# Altium schematic sheet 3d_dsn_approx.SchDoc
size A1; SheetNumber: 1; SheetTotal: 13
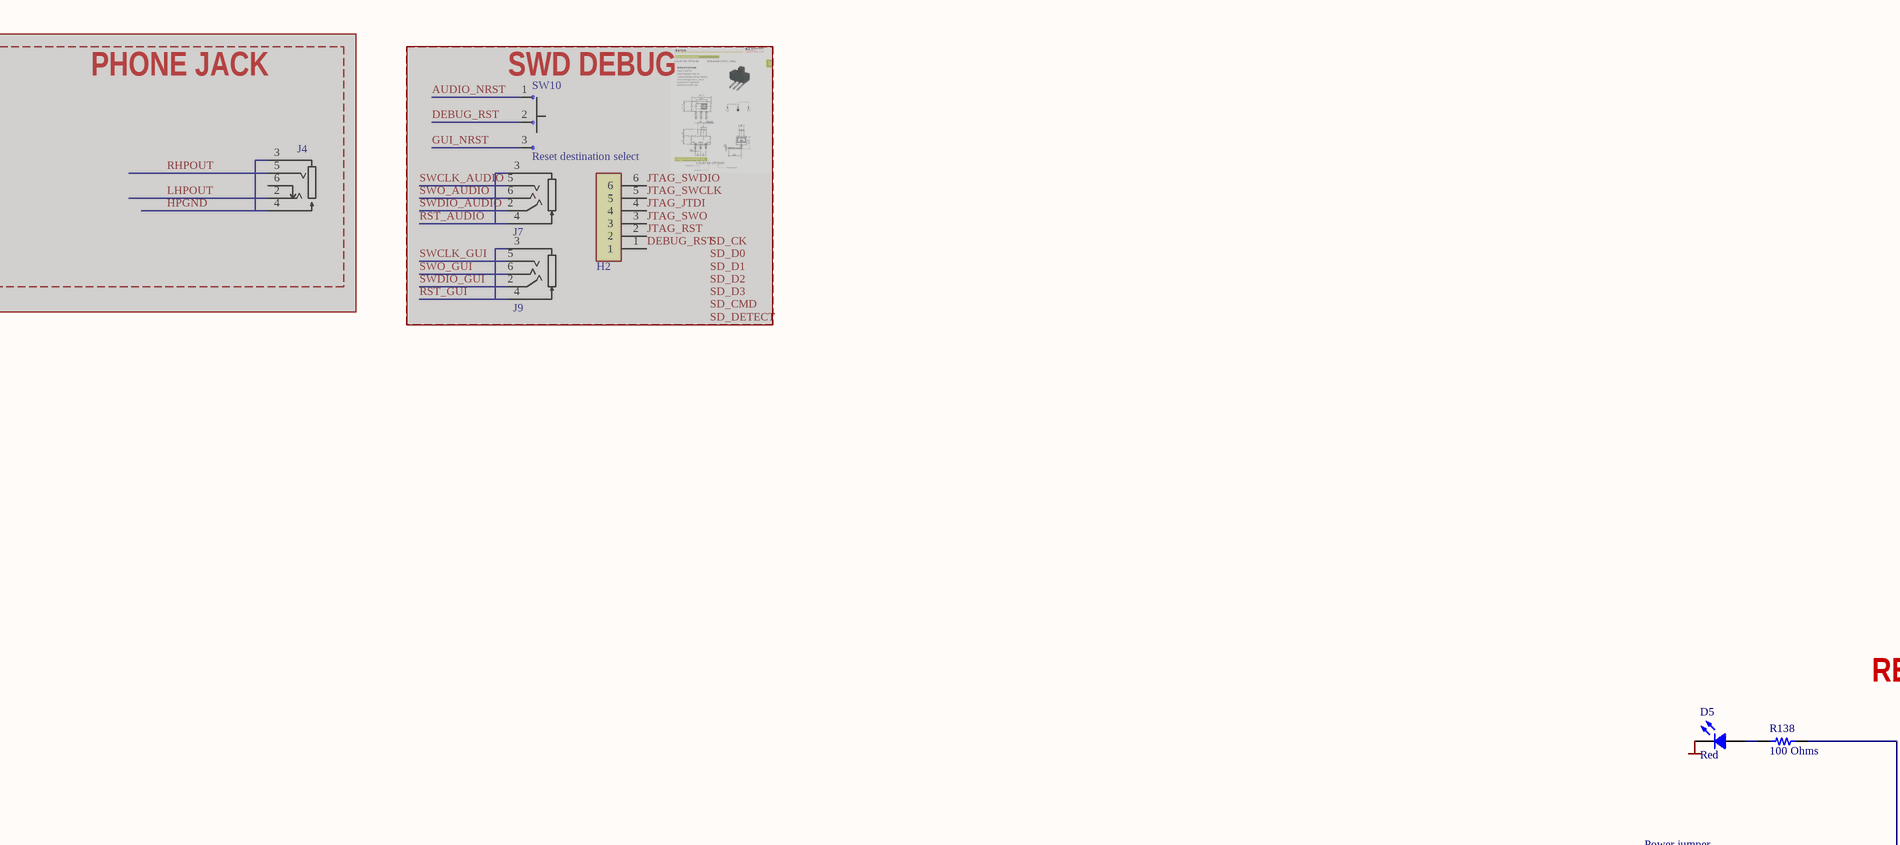
[diagram p0: 3d_dsn_approx.SchDoc, top left]
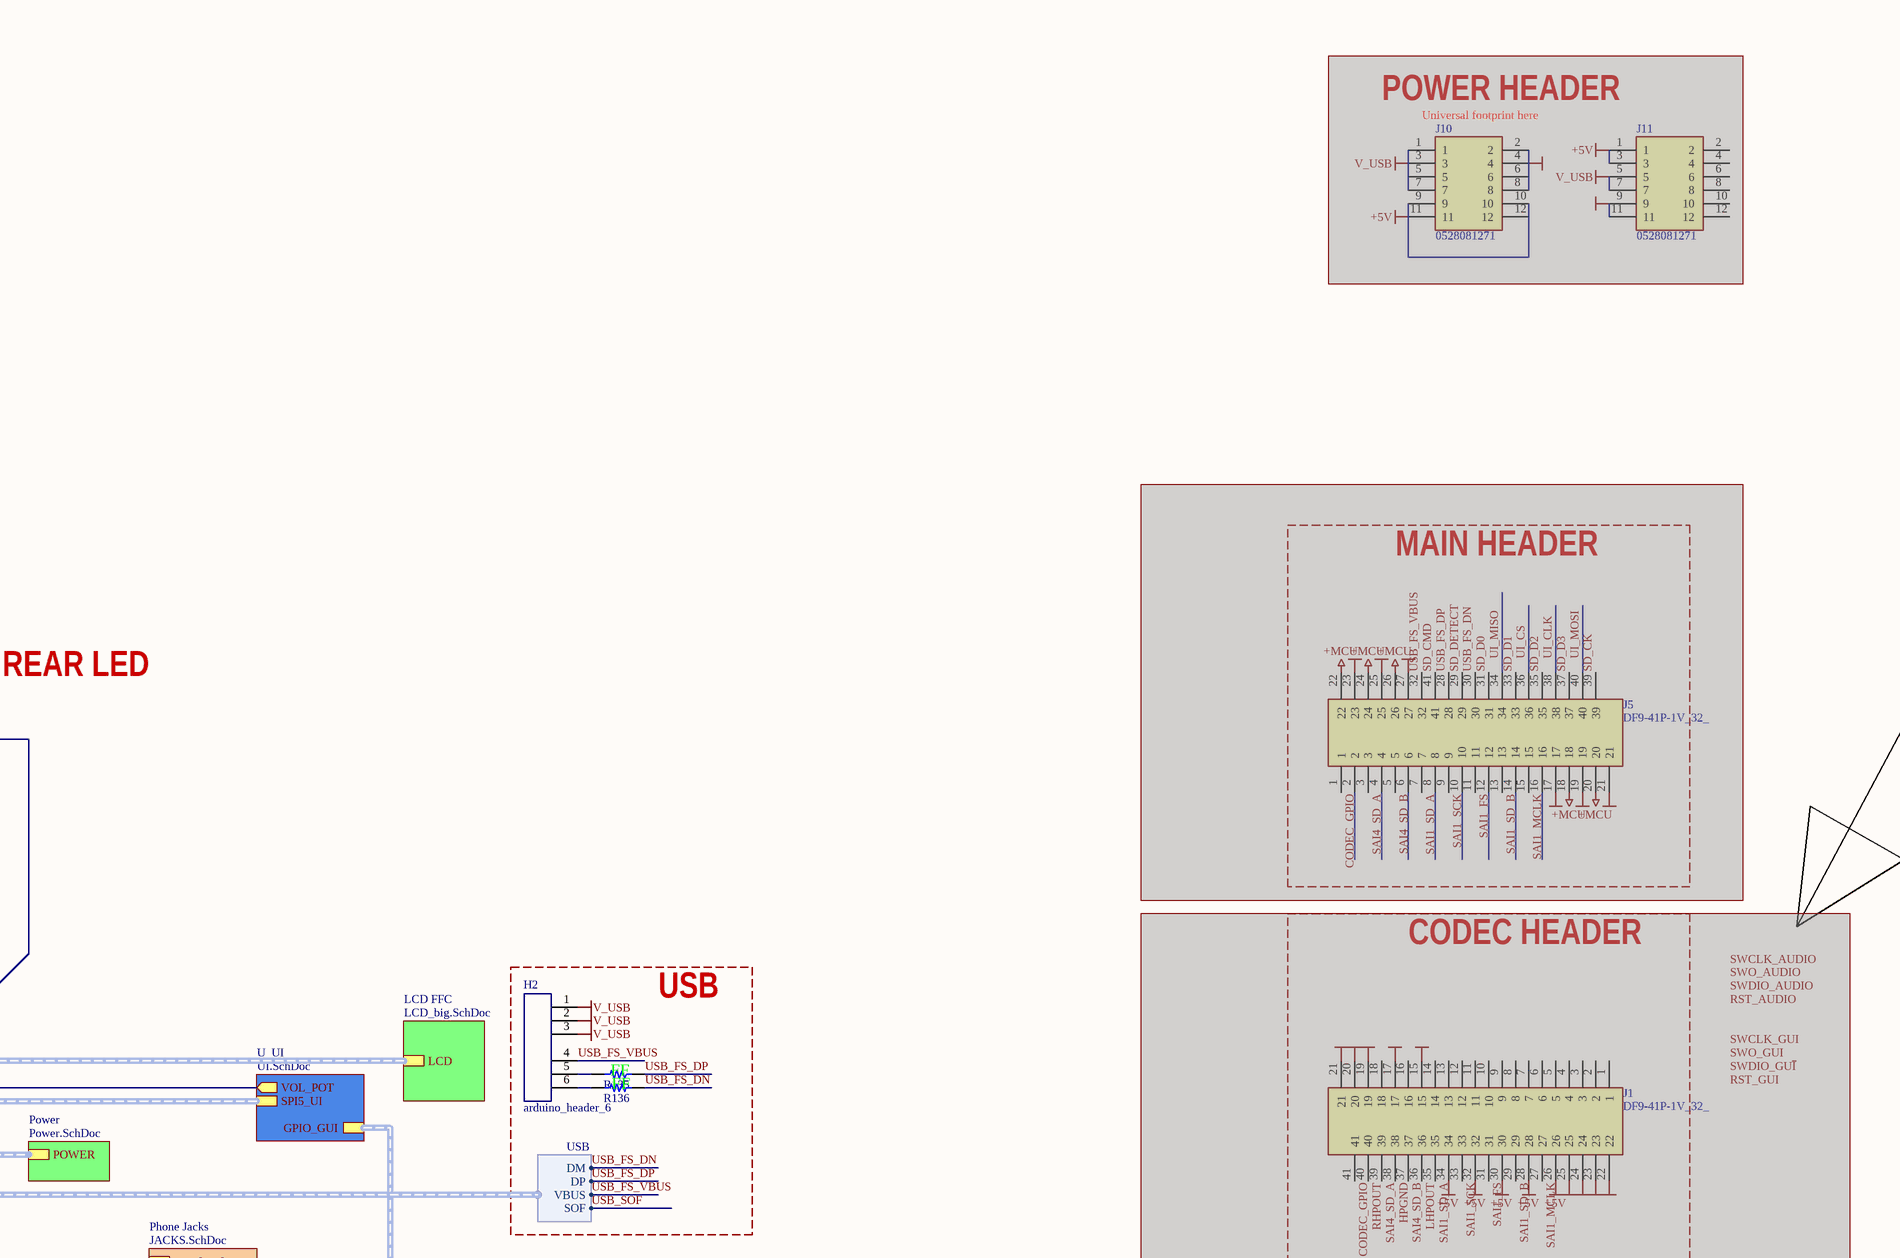
[diagram p1: 3d_dsn_approx.SchDoc, top right]
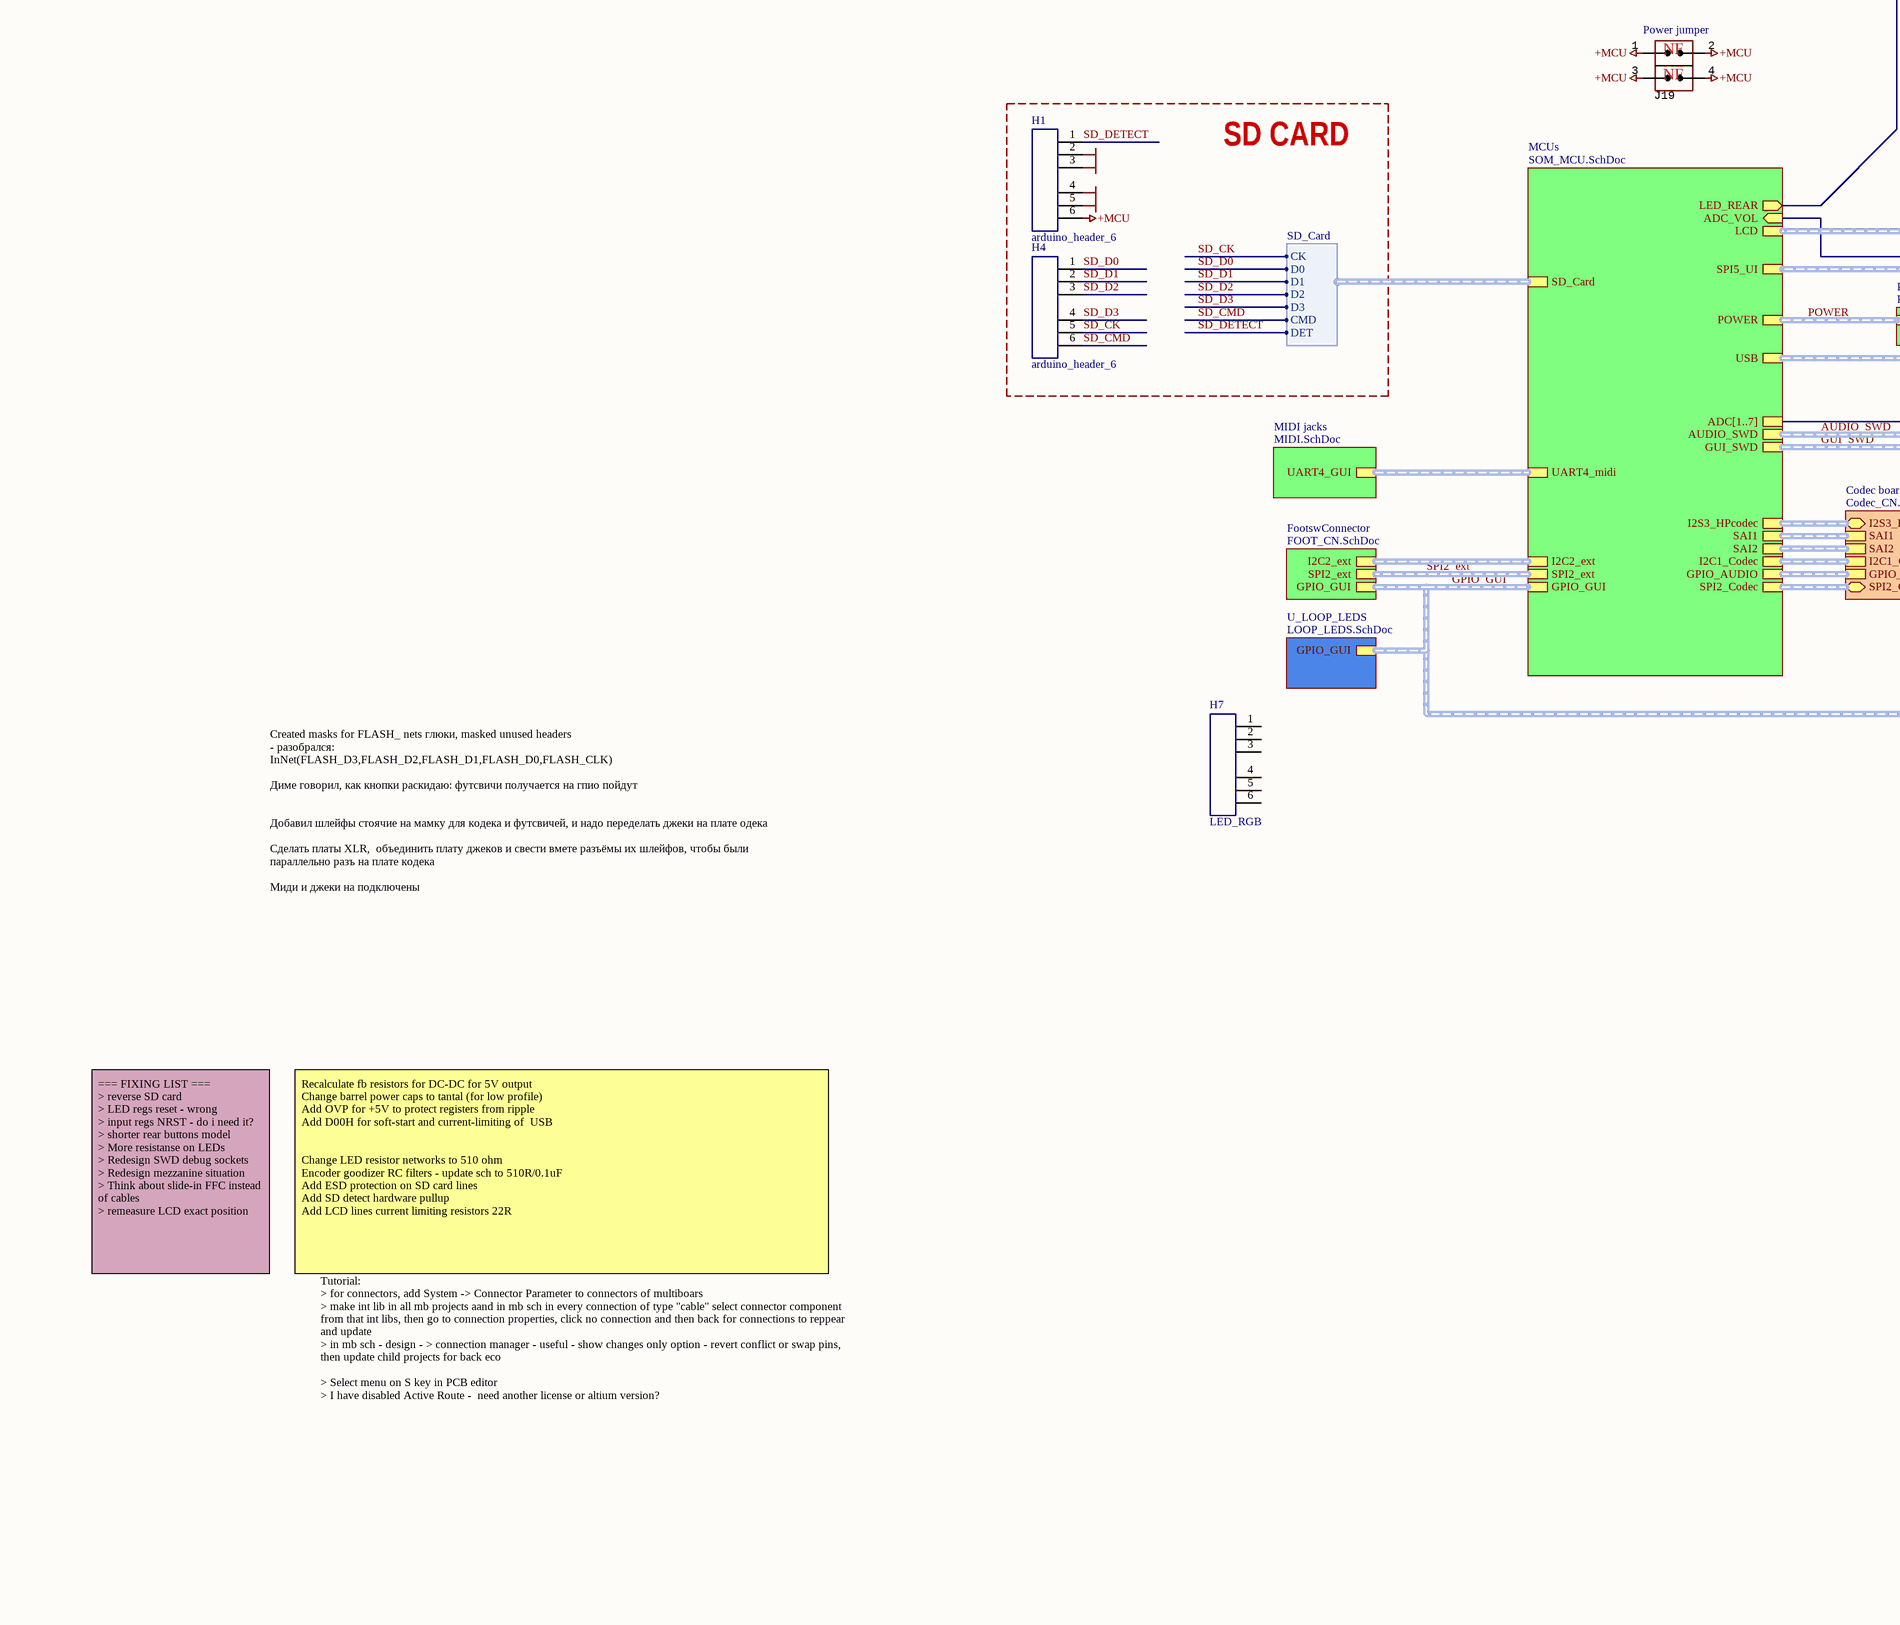
[diagram p2: 3d_dsn_approx.SchDoc, bottom left]
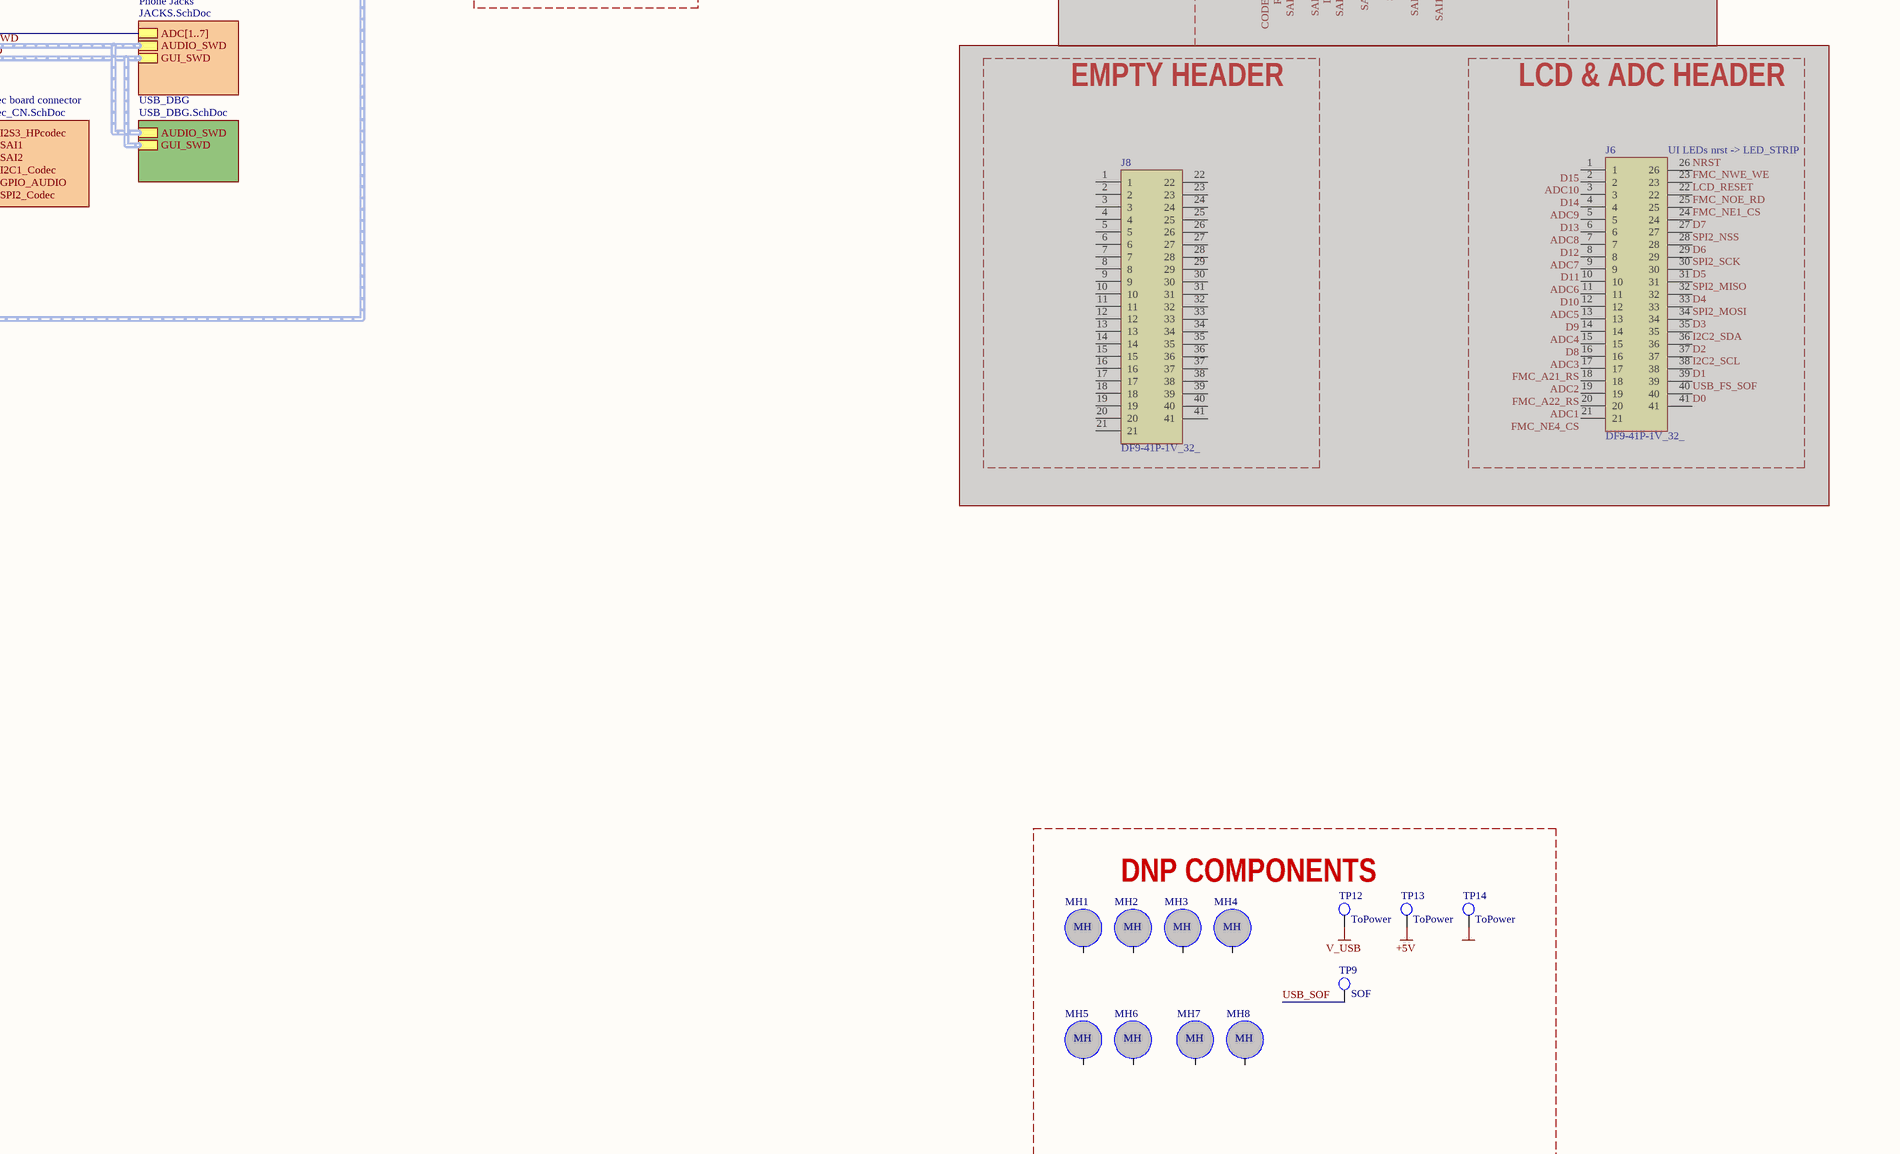
[diagram p3: 3d_dsn_approx.SchDoc, bottom right]

## Parts
(Parts that share a designator on the sheet are numbered #1, #2 ... from top to bottom, then left to right.)
D5  Red  [LED 0805_2012 RED]
H1  arduino_header_6  [header-6_female]
H2#1  1.5-6A  [1.5-6A]  (value not drawn)  (masked out: inside a compile mask, not in the netlist)
H2#2  arduino_header_6  [header-6_female]
H4  arduino_header_6  [header-6_female]
H7  LED_RGB  [header-6_male]
J1  DF9-41P-1V_32_  [HIROSE_DF9-41P-1V(32)]  (masked out: inside a compile mask, not in the netlist)
J4  35RASMT2BHNTRX  [PJ_327]  (value not drawn)  (masked out: inside a compile mask, not in the netlist)
J5  DF9-41P-1V_32_  [HIROSE_DF9-41P-1V(32)]  (masked out: inside a compile mask, not in the netlist)
J6  DF9-41P-1V_32_  [HIROSE_DF9-41P-1V(32)]  (masked out: inside a compile mask, not in the netlist)
J7  PJ-327F  [PJ-327F]  (value not drawn)  (masked out: inside a compile mask, not in the netlist)
J8  DF9-41P-1V_32_  [HIROSE_DF9-41P-1V(32)]  (masked out: inside a compile mask, not in the netlist)
J9  PJ-327F  [PJ-327F]  (value not drawn)  (masked out: inside a compile mask, not in the netlist)
J10  0528081271  [AFA11-S12GLA-00]  (masked out: inside a compile mask, not in the netlist)
J11  0528081271  [AFA11-S12GLA-00]  (masked out: inside a compile mask, not in the netlist)
J19  (no value)  [CON: JUMPER x2]
MH1  MountingHole  [Hole_2.5mm]  (value not drawn)
MH2  MountingHole  [Hole_2.5mm]  (value not drawn)
MH3  MountingHole  [Hole_2.5mm]  (value not drawn)
MH4  MountingHole  [Hole_2.5mm]  (value not drawn)
MH5  MountingHole  [Hole_2.5mm]  (value not drawn)
MH6  MountingHole  [Hole_2.5mm]  (value not drawn)
MH7  MountingHole  [Hole_2.5mm]  (value not drawn)
MH8  MountingHole  [Hole_2.5mm]  (value not drawn)
R135  (no value)  [RES 0603_1608]
R136  (no value)  [RES 0603_1608]
R138  100 Ohms  [RES 0402_1005]
SW10  Reset destination select  [SLIDE_SW_BIG]  (masked out: inside a compile mask, not in the netlist)
TP9  SOF  [TESTPOINT_PAD]
TP12  ToPower  [TESTPOINT_PAD]
TP13  ToPower  [TESTPOINT_PAD]
TP14  ToPower  [TESTPOINT_PAD]

## Blocks framed on the sheet
PHONE JACK: J4
SWD DEBUG: H2#1 J7 J9 SW10
MAIN HEADER: J5
CODEC HEADER: J1
SD CARD: H1 H4
USB: H2#2 R135 R136
EMPTY HEADER: J8
LCD & ADC HEADER: J6
DNP COMPONENTS: MH1-MH8 TP9 TP12-TP14

## Sub-sheets
Codec board connector = Codec_CN.SchDoc: SAI1 (harness SAI), SAI2 (harness SAI), I2C1_Codec (harness I2C), GPIO_AUDIO (harness GPIO_AUDIO), I2S3_HPcodec (bidir), SPI2_Codec (bidir)
FootswConnector = FOOT_CN.SchDoc: I2C2_ext (harness I2C), SPI2_ext (harness GPIO_GUI), GPIO_GUI (harness GPIO_GUI)
LCD FFC = LCD_big.SchDoc: LCD (harness LCD)
MCUs = SOM_MCU.SchDoc: SD_Card (harness SD_Card), LCD (harness LCD), I2C2_ext (harness GPIO_GUI), SPI2_ext (harness GPIO_GUI), SPI5_UI (harness USB), USB (harness USB), SAI1, SAI2, I2C1_Codec, GPIO_AUDIO, UART4_midi (harness SD_Card), GUI_SWD (harness SWD), AUDIO_SWD (harness SWD), GPIO_GUI (harness GPIO_GUI), POWER (harness POWER), ADC[1..7], ADC_VOL (in), LED_REAR (out), I2S3_HPcodec, SPI2_Codec
MIDI jacks = MIDI.SchDoc: UART4_GUI (harness UART)
Phone Jacks = JACKS.SchDoc: GUI_SWD (harness SWD), AUDIO_SWD (harness SWD), ADC[1..7]
Power = Power.SchDoc: POWER (harness POWER)
U_LOOP_LEDS = LOOP_LEDS.SchDoc: GPIO_GUI (harness GPIO_GUI)
U_UI = UI.SchDoc: VOL_POT (out), SPI5_UI (harness USB), GPIO_GUI (harness GPIO_GUI)
USB_DBG = USB_DBG.SchDoc: GUI_SWD (harness SWD), AUDIO_SWD (harness SWD)

## Harnesses
SD_Card: CK, D0, D1, D2, D3, CMD, DET
USB: DM, DP, VBUS, SOF

## Nets
+5V: TP13.1
+MCU: H1.6 J19.1(IN) J19.2(IN) J19.3(IN) J19.4(IN)
GND: D5.2 H1.2 H1.3 H1.4 H1.5 TP14.1
V_USB: H2#2.1 H2#2.2 H2#2.3 TP12.1
SD_CK: H4.5 ; sheet MCUs/SD_Card.CK
SD_CMD: H4.6 ; sheet MCUs/SD_Card.CMD
SD_D0: H4.1 ; sheet MCUs/SD_Card.D0
SD_D1: H4.2 ; sheet MCUs/SD_Card.D1
SD_D2: H4.3 ; sheet MCUs/SD_Card.D2
SD_D3: H4.4 ; sheet MCUs/SD_Card.D3
SD_DETECT: H1.1 ; sheet MCUs/SD_Card.DET
USB_FS_DN: R136.1 ; sheet MCUs/USB.DM
USB_FS_DP: R135.1 ; sheet MCUs/USB.DP
USB_FS_VBUS: H2#2.4 ; sheet MCUs/USB.VBUS
USB_SOF: TP9.1 ; sheet MCUs/USB.SOF
NetD5_1: D5.1 R138.1
NetH2#2_5: H2#2.5 R135.2
NetH2#2_6: H2#2.6 R136.2
NetR138_2: R138.2 ; sheet MCUs/LED_REAR
(unnamed): sheet MCUs/ADC_VOL, sheet U_UI/VOL_POT

Not connected (* = marked no-connect by the designer): H7 1 2 3 4 5 6; MH1 0; MH2 0; MH3 0; MH4 0; MH5 0; MH6 0; MH7 0; MH8 0

## Buses and harness runs
bus sheet MCUs/ADC[1..7] = sheet Phone Jacks/ADC[1..7]
harness AUDIO_SWD = sheet MCUs/AUDIO_SWD = sheet Phone Jacks/AUDIO_SWD = sheet USB_DBG/AUDIO_SWD
harness GPIO_GUI = sheet FootswConnector/GPIO_GUI = sheet MCUs/GPIO_GUI = sheet U_LOOP_LEDS/GPIO_GUI = sheet U_UI/GPIO_GUI
harness GUI_SWD = sheet MCUs/GUI_SWD = sheet Phone Jacks/GUI_SWD = sheet USB_DBG/GUI_SWD
harness POWER = sheet MCUs/POWER = sheet Power/POWER
harness sheet Codec board connector/GPIO_AUDIO = sheet MCUs/GPIO_AUDIO
harness sheet Codec board connector/I2C1_Codec = sheet MCUs/I2C1_Codec
harness sheet Codec board connector/I2S3_HPcodec = sheet MCUs/I2S3_HPcodec
harness sheet Codec board connector/SAI1 = sheet MCUs/SAI1
harness sheet Codec board connector/SAI2 = sheet MCUs/SAI2
harness sheet Codec board connector/SPI2_Codec = sheet MCUs/SPI2_Codec
harness sheet FootswConnector/I2C2_ext = sheet MCUs/I2C2_ext
harness sheet LCD FFC/LCD = sheet MCUs/LCD
harness sheet MCUs/SPI5_UI = sheet U_UI/SPI5_UI
harness sheet MCUs/UART4_midi = sheet MIDI jacks/UART4_GUI
harness SPI2_ext = sheet FootswConnector/SPI2_ext = sheet MCUs/SPI2_ext

## Notes on the sheet
- POWER HEADER
- (near J10) Universal footprint here
- REAR LED
- (near J19) Power jumper
- (near J19) NF
- (near R135) FF
- FF
- (near J6) UI LEDs nrst -> LED_STRIP
- Created masks for FLASH_ nets глюки, masked unused headers
  - разобрался:
  InNet(FLASH_D3,FLASH_D2,FLASH_D1,FLASH_D0,FLASH_CLK)
  Диме говорил, как кнопки раскидаю: футсвичи получается на гпио пойдут
  Добавил шлейфы стоячие на мамку для кодека и футсвичей, и надо переделать джеки на плате одека
  Сделать платы XLR,  объединить плату джеков и свести вмете разъёмы их шлейфов, чтобы были параллельно разъ на плате кодека
  Миди и джеки на подключены
- Recalculate fb resistors for DC-DC for 5V output
  Change barrel power caps to tantal (for low profile)
  Add OVP for +5V to protect registers from ripple
  Add D00H for soft-start and current-limiting of  USB
  Change LED resistor networks to 510 ohm
  Encoder goodizer RC filters - update sch to 510R/0.1uF
  Add ESD protection on SD card lines
  Add SD detect hardware pullup
  Add LCD lines current limiting resistors 22R
- Tutorial:
  > for connectors, add System -> Connector Parameter to connectors of multiboars
  > make int lib in all mb projects aand in mb sch in every connection of type "cable" select connector component from that int libs, then go to connection properties, click no connection and then back for connections to reppear and update
  > in mb sch - design - > connection manager - useful - show changes only option - revert conflict or swap pins, then update child projects for back eco
  > Select menu on S key in PCB editor
  > I have disabled Active Route -  need another license or altium version?
- (in symbol MountingHole) MH

## Library data of the parts
D5 = LSM0805412V: LED RED CLEAR 0805 SMD; Manufacturer: Visual Communications Company - VCC; Configuration: 0805; Current - Test: 20mA; Lens Color: Colorless; Lens Size: 1.40mm x 1.20mm; Lens Style: Rectangle with Flat Top; Millicandela Rating: 100mcd; Viewing Angle: 120°; Voltage - Forward (Vf) (Typ): 2V; Wavelength - Dominant: 625nm; Part Number: LSM0805412V; Color: Red; ComponentLink1Description: Datasheet; ComponentLink1URL: https://www.vcclite.com/wp-content/uploads/wpallimport/files/files/LSM0805452V-Green-Datasheet.pdf; ComponentLink2Description: DigiKey Link; ComponentLink2URL: https://www.digikey.com/en/products/detail/visual-communications-company-vcc/LSM0805412V/10229616; Device Package: 0805 (2012 Metric); Height (Max): 0.90mm; LastUpdated: 6/3/2024 8:00:06 PM; Lens Transparency: Clear; Lifecycle Status: Active; Minimum Order: 1; Mounting Type: Surface Mount; Package / Case: 0805 (2012 Metric); Packaging: TapeAndReel; PartId: 336; Part Status: Active; Price: 0.11; Series: LSM0805; Size / Dimension: 2.00mm L x 1.25mm W; Supplier 1: DigiKey; Supplier Part Number 1: 28-LSM0805412VCT-ND; Supplier Device Package: 0805; Value: Red; Wavelength - Peak: 625nm
H1 H2#2 H4 H7 = arduino_header_6: System: Connector
H2#1 = 1.5-6A: Pin Header p=1.5mm, 6 pins
J1 J5 J6 J8 = DF9-41P-1V_32_: Connector; Manufacturer_Name: Hirose; Manufacturer_Part_Number: DF9-41P-1V(32); Datasheet Link: http://componentsearchengine.com/Datasheets/1/DF9-41P-1V(32).pdf; Mouser Part Number: 798-DF9-41P-1V32; Mouser Price/Stock: https://www.mouser.co.uk/ProductDetail/Hirose-Connector/DF9-41P-1V32?qs=zOgoZG1CgI%252BzVCgniEkwOw%3D%3D; Arrow Part Number: DF9-41P-1V(32); Arrow Price/Stock: https://www.arrow.com/en/products/df9-41p-1v-32/hirose-electric
J4 = 3.5mm jack stereo smd: Conn 3.5MM Stereo Jack F 3 POS Solder RA SMD 3 Terminal 1 Port T/R; MF: Switchcraft; MP: 35RASMT2BHNTRX; Package: None; Price: 0.84 USD; Availability: Good; SnapEDA_Link: https://www.snapeda.com/parts/35RASMT2BHNTRX/Switchcraft%20Inc./view-part/?ref=snap; Value: *
J7 J9 = 3.5mm jack 4pos smd: PJ-327F 4 contacts 5 pins 1 sw
J10 J11 = 0528081271: Connector; Manufacturer_Name: Molex; Datasheet Link: https://www.molex.com/pdm_docs/sd/528082071_sd.pdf; Height: 5.3mm; Manufacturer_Part_Number: 0528081271; System: Connector
J19 = Jumper_double: CommentText: "Перемычка"
R135 R136 = RCA06030000ZSEA: RES SMD 0 OHM JUMPER 1/10W 0603; Manufacturer: Vishay Dale; Power (Watts): 0.1W, 1/10W; Part Number: RCA06030000ZSEA; ComponentLink1Description: Datasheet; ComponentLink1URL: http://www.vishay.com/docs/20037/rcae3.pdf; ComponentLink2Description: DigiKey Link; ComponentLink2URL: http://digikey.com/product-detail/en/vishay-dale/RCA06030000ZSEA/541-2192-1-ND/4946845; Composition: Thick Film; Device Package: 0603 (1608 Metric); Features: Anti-Sulfur, Automotive AEC-Q200; Height - Seated (Max): 0.020" (0.50mm); LastUpdated: 9/2/2020 1:10:23 AM; Lifecycle Status: Active; Minimum Order: 1; Number of Terminations: 2; Operating Temperature: -55°C ~ 155°C; Package / Case: 0603 (1608 Metric); Packaging: TapeAndReel; PartId: 5740; Part Status: Active; Price: 0.01; Ratings: AEC-Q200; Series: RCA; Size / Dimension: 0.061" L x 0.033" W (1.55mm x 0.85mm); Supplier 1: DigiKey; Supplier Part Number 1: 541-2192-1-ND; Supplier Device Package: 0603; Tolerance: Jumper
R138 = CRCW0402100RFKEE: RES SMD 100 OHM 1% 1/16W 0402; Manufacturer: Vishay Dale; Power (Watts): 0.063W, 1/16W; Temperature Coefficient: ±100ppm/°C; Part Number: CRCW0402100RFKEE; Value: 100 Ohms; ComponentLink1Description: Datasheet; ComponentLink1URL: http://www.vishay.com/docs/20035/dcrcwe3.pdf; ComponentLink2Description: DigiKey Link; ComponentLink2URL: https://www.digikey.com/en/products/detail/vishay-dale/CRCW0402100RFKEE/5069886; Composition: Thick Film; Device Package: 0402 (1005 Metric); Height - Seated (Max): 0.016" (0.40mm); LastUpdated: 2/9/2024 8:30:05 PM; Lifecycle Status: Active; Minimum Order: 1; Number of Terminations: 2; Operating Temperature: -55°C ~ 155°C; Package / Case: 0402 (1005 Metric); Packaging: CutTape; PartId: 6830; Part Status: Active; Price: 0.01; Resistance: 100 Ohms; Series: CRCW; Size / Dimension: 0.039" L x 0.020" W (1.00mm x 0.50mm); Supplier 1: DigiKey; Supplier Part Number 1: 541-2953-1-ND; Supplier Device Package: 0402; Tolerance: ±1%; Features: Automotive AEC-Q200; Ratings: AEC-Q200
SW10 = RockerSwitch_3mm: Slide switch L-KLS7-SS-12F19-G5
TP9 TP12-TP14 = TestPoint